# Altium schematic sheet LED_indication.SchDoc
size A4
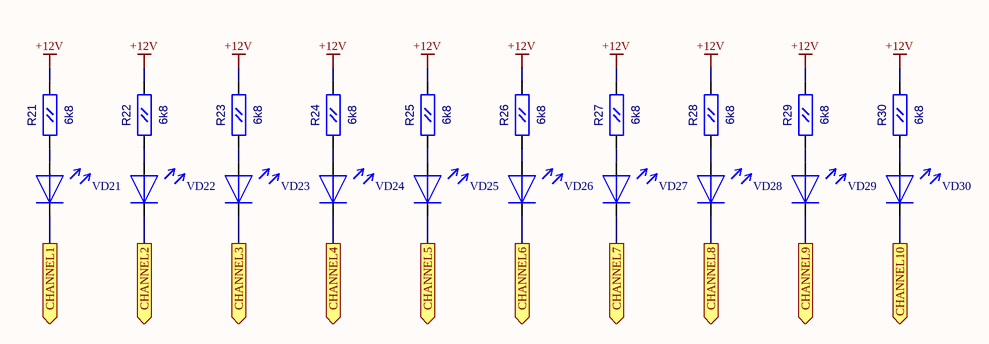
[diagram p0: LED_indication.SchDoc]

## Parts
R21  6k8  [RC0603]
R22  6k8  [RC0603]
R23  6k8  [RC0603]
R24  6k8  [RC0603]
R25  6k8  [RC0603]
R26  6k8  [RC0603]
R27  6k8  [RC0603]
R28  6k8  [RC0603]
R29  6k8  [RC0603]
R30  6k8  [RC0603]
VD21  BL-HS135A-TRB  [LED0805]  (value not drawn)
VD22  BL-HS135A-TRB  [LED0805]  (value not drawn)
VD23  BL-HS135A-TRB  [LED0805]  (value not drawn)
VD24  BL-HS135A-TRB  [LED0805]  (value not drawn)
VD25  BL-HS135A-TRB  [LED0805]  (value not drawn)
VD26  BL-HS135A-TRB  [LED0805]  (value not drawn)
VD27  BL-HS135A-TRB  [LED0805]  (value not drawn)
VD28  BL-HS135A-TRB  [LED0805]  (value not drawn)
VD29  BL-HS135A-TRB  [LED0805]  (value not drawn)
VD30  BL-HS135A-TRB  [LED0805]  (value not drawn)

## Ports
CHANNEL1 (out), CHANNEL2 (out), CHANNEL3 (out), CHANNEL4 (out), CHANNEL5 (out), CHANNEL6 (out), CHANNEL7 (out), CHANNEL8 (out), CHANNEL9 (out), CHANNEL10 (out)

## Nets
+12V: R21.2(B) R22.2(B) R23.2(B) R24.2(B) R25.2(B) R26.2(B) R27.2(B) R28.2(B) R29.2(B) R30.2(B)
CHANNEL1: VD21.2 ; port CHANNEL1
CHANNEL2: VD22.2 ; port CHANNEL2
CHANNEL3: VD23.2 ; port CHANNEL3
CHANNEL4: VD24.2 ; port CHANNEL4
CHANNEL5: VD25.2 ; port CHANNEL5
CHANNEL6: VD26.2 ; port CHANNEL6
CHANNEL7: VD27.2 ; port CHANNEL7
CHANNEL8: VD28.2 ; port CHANNEL8
CHANNEL9: VD29.2 ; port CHANNEL9
CHANNEL10: VD30.2 ; port CHANNEL10
NetR21_1: R21.1(A) VD21.1
NetR22_1: R22.1(A) VD22.1
NetR23_1: R23.1(A) VD23.1
NetR24_1: R24.1(A) VD24.1
NetR25_1: R25.1(A) VD25.1
NetR26_1: R26.1(A) VD26.1
NetR27_1: R27.1(A) VD27.1
NetR28_1: R28.1(A) VD28.1
NetR29_1: R29.1(A) VD29.1
NetR30_1: R30.1(A) VD30.1

## Library data of the parts
R21-R30 = RC0603: Value: 6k8
VD21-VD30 = LED_0805: Value: BL-HS135A-TRB